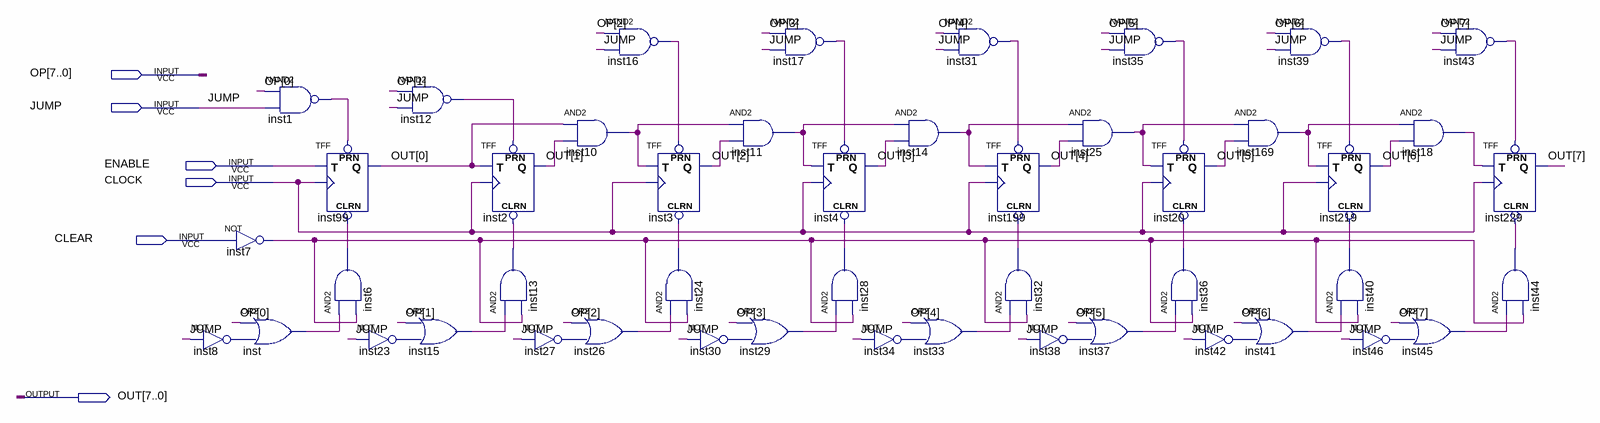
[diagram p0: schematic sheet]
// Quartus schematic CONTADOR.bdf as structural Verilog: 47 symbols, 6 pins
module CONTADOR (
  input  [7:0] OP,
  input  JUMP,
  input  ENABLE,
  input  CLOCK,
  input  CLEAR,
  output [7:0] OUT
);

  wire inst1_out, inst6_out, inst7_out, inst8_out, inst10_out, inst11_out, inst12_out, inst13_out,
       inst14_out, inst15_out, inst16_out, inst17_out, inst18_out, inst23_out, inst24_out, inst25_out,
       inst26_out, inst27_out, inst28_out, inst29_out, inst30_out, inst31_out, inst32_out, inst33_out,
       inst34_out, inst35_out, inst36_out, inst37_out, inst38_out, inst39_out, inst40_out, inst41_out,
       inst42_out, inst43_out, inst44_out, inst45_out, inst46_out, inst169_out, inst_out;

  not inst8 (inst8_out, JUMP);
  nand inst1 (inst1_out, OP[0], JUMP);
  not inst7 (inst7_out, CLEAR);
  or inst (inst_out, OP[0], inst8_out);
  TFF inst99 (.PRN(inst1_out), .CLRN(inst6_out), .T(ENABLE), .CLK(CLOCK), .Q(OUT[0]));
  and inst6 (inst6_out, inst_out, inst7_out);
  nand inst12 (inst12_out, OP[1], JUMP);
  or inst15 (inst15_out, OP[1], inst23_out);
  not inst23 (inst23_out, JUMP);
  TFF inst2 (.PRN(inst12_out), .CLRN(inst13_out), .T(OUT[0]), .CLK(CLOCK), .Q(OUT[1]));
  and inst13 (inst13_out, inst15_out, inst7_out);
  not inst27 (inst27_out, JUMP);
  nand inst16 (inst16_out, OP[2], JUMP);
  and inst10 (inst10_out, OUT[0], OUT[1]);
  or inst26 (inst26_out, OP[2], inst27_out);
  TFF inst3 (.PRN(inst16_out), .CLRN(inst24_out), .T(inst10_out), .CLK(CLOCK), .Q(OUT[2]));
  and inst24 (inst24_out, inst26_out, inst7_out);
  and inst11 (inst11_out, inst10_out, OUT[2]);
  or inst29 (inst29_out, OP[3], inst30_out);
  not inst30 (inst30_out, JUMP);
  nand inst17 (inst17_out, OP[3], JUMP);
  TFF inst4 (.PRN(inst17_out), .CLRN(inst28_out), .T(inst11_out), .CLK(CLOCK), .Q(OUT[3]));
  and inst28 (inst28_out, inst29_out, inst7_out);
  not inst34 (inst34_out, JUMP);
  and inst14 (inst14_out, inst11_out, OUT[3]);
  or inst33 (inst33_out, OP[4], inst34_out);
  nand inst31 (inst31_out, OP[4], JUMP);
  TFF inst199 (.PRN(inst31_out), .CLRN(inst32_out), .T(inst14_out), .CLK(CLOCK), .Q(OUT[4]));
  and inst32 (inst32_out, inst33_out, inst7_out);
  and inst25 (inst25_out, inst14_out, OUT[4]);
  not inst38 (inst38_out, JUMP);
  nand inst35 (inst35_out, OP[5], JUMP);
  or inst37 (inst37_out, OP[5], inst38_out);
  TFF inst20 (.PRN(inst35_out), .CLRN(inst36_out), .T(inst25_out), .CLK(CLOCK), .Q(OUT[5]));
  and inst36 (inst36_out, inst37_out, inst7_out);
  not inst42 (inst42_out, JUMP);
  and inst169 (inst169_out, inst25_out, OUT[5]);
  or inst41 (inst41_out, OP[6], inst42_out);
  nand inst39 (inst39_out, OP[6], JUMP);
  TFF inst219 (.PRN(inst39_out), .CLRN(inst40_out), .T(inst169_out), .CLK(CLOCK), .Q(OUT[6]));
  and inst40 (inst40_out, inst41_out, inst7_out);
  and inst18 (inst18_out, inst169_out, OUT[6]);
  or inst45 (inst45_out, OP[7], inst46_out);
  not inst46 (inst46_out, JUMP);
  nand inst43 (inst43_out, OP[7], JUMP);
  TFF inst229 (.PRN(inst43_out), .CLRN(inst44_out), .T(inst18_out), .CLK(CLOCK), .Q(OUT[7]));
  and inst44 (inst44_out, inst45_out, inst7_out);
endmodule
